# EAGLE design line_kick (EAGLE 9.4.0)
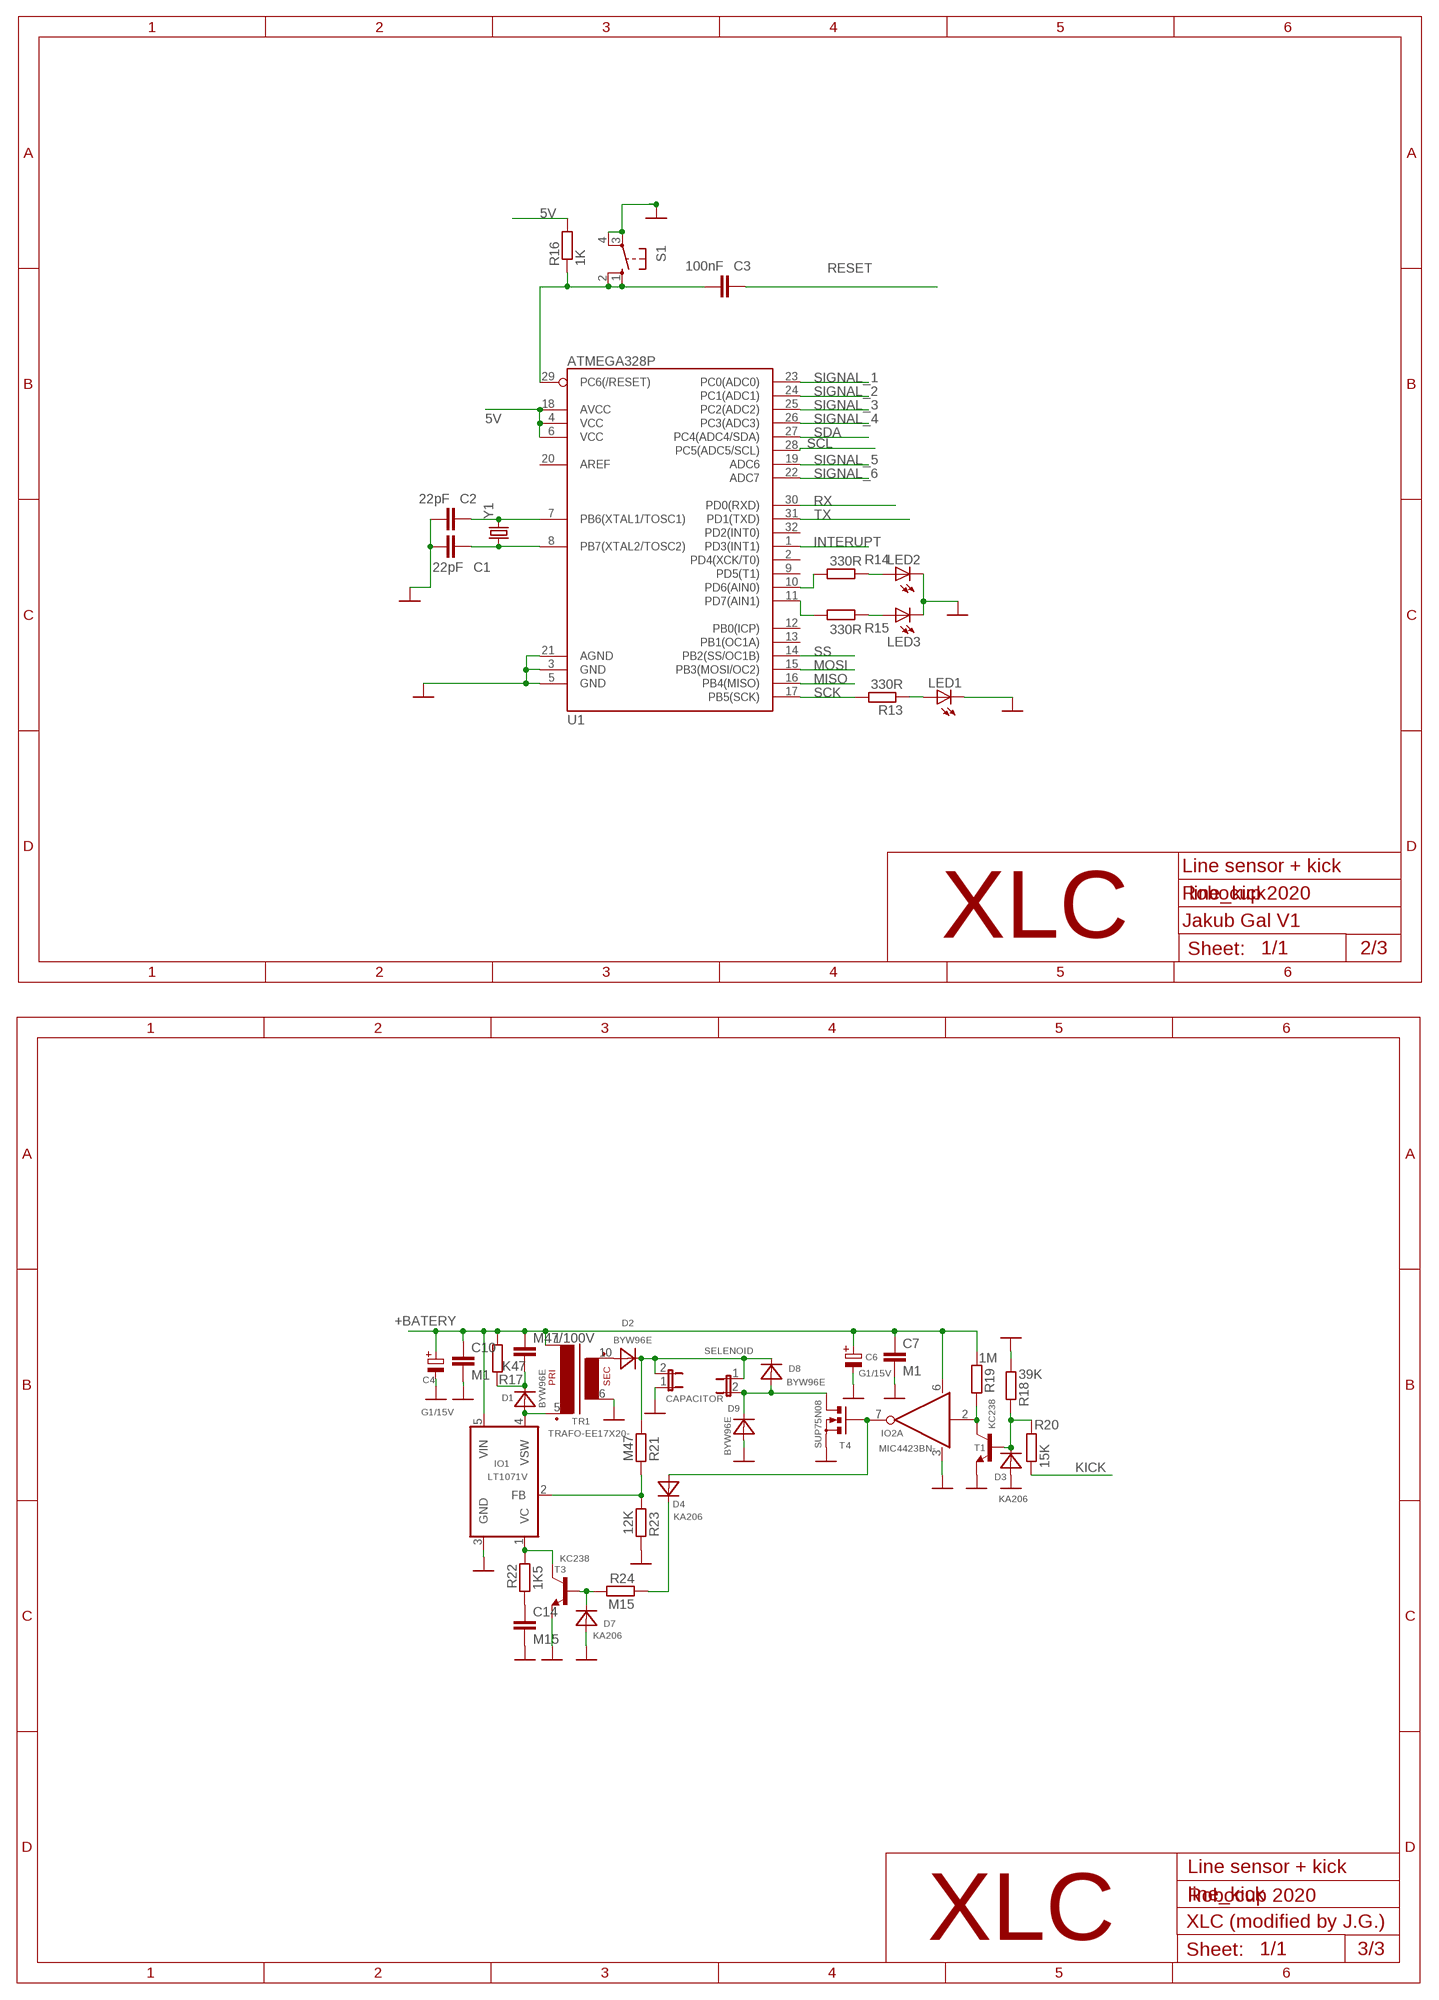
[diagram p0: schematic, sheet 1, part 1 of 2]
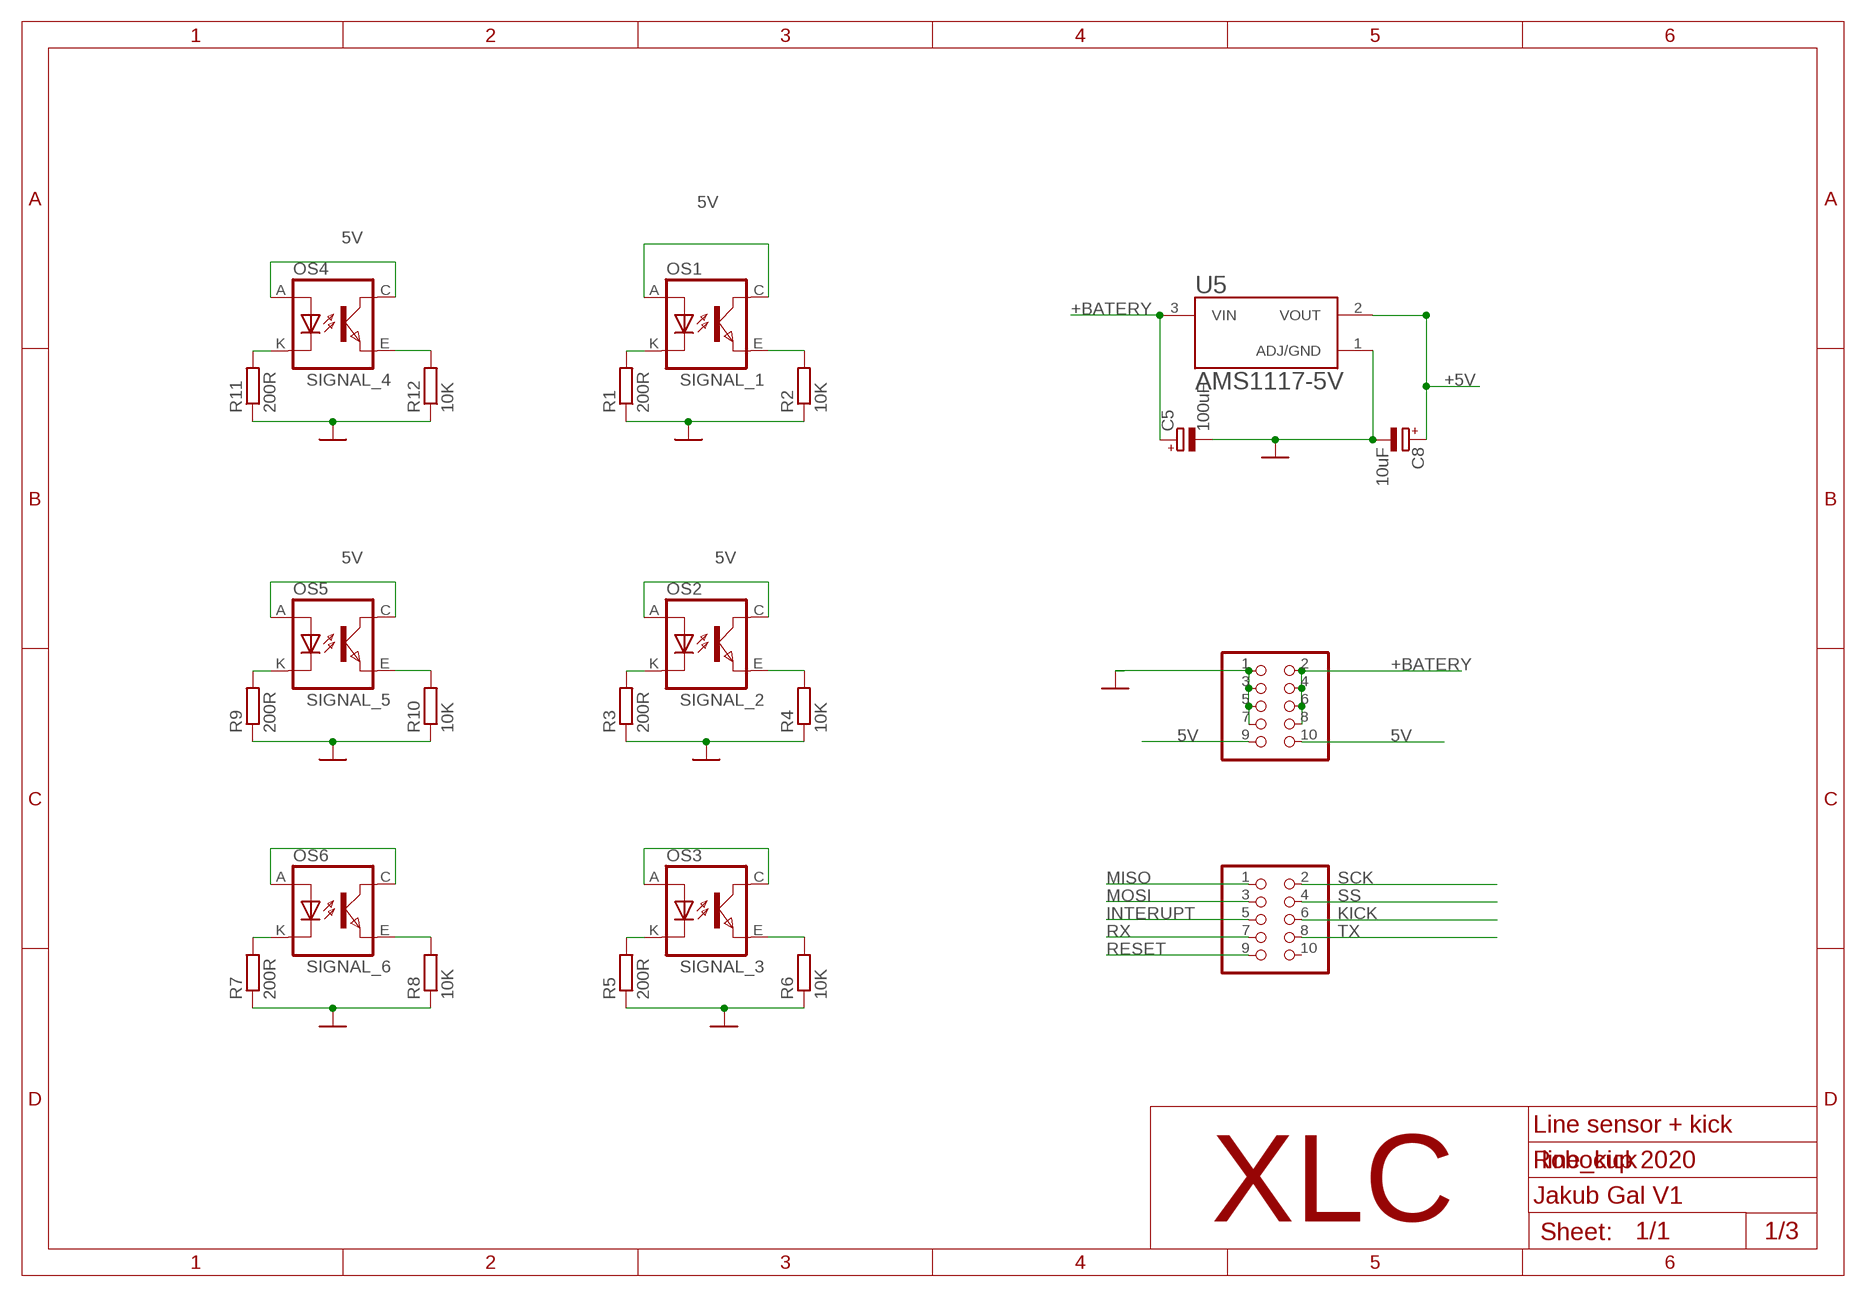
[diagram p1: schematic, sheet 1, part 2 of 2]

## Parts
C1  22pF  C-EUC0603  [C0603]
C2  22pF  C-EUC0603  [C0603]
C3  100nF  C-EUC0603  [C0603]
C4  G1/15V  KOND-ELEKT-2,5/7  [E-2,5/7-RAD]
C5  100uF  CPOL-EUUD-6,3X7,7  [UD-6,3X7,7_NICHICON]
C6  G1/15V  KOND-ELEKT-2,5/7  [E-2,5/7-RAD]
C7  M1  C-EUC0805K  [C0805K]
C8  10uF  CPOL-EUUD-4X5,8  [UD-4X5,8_NICHICON]
C10  M1  C-EUC0805K  [C0805K]
C14  M15  C-EUC0805K  [C0805K]
CAPACITOR  JP2EN  [JP2E]
D1  BYW96E  DIODA-10MM  [D-10]
D2  BYW96E  DIODA-10MM  [D-10]
D3  KA206  DIODA-7,5MM  [D-7,5]
D4  KA206  DIODA-7,5MM  [D-7,5]
D7  KA206  DIODA-7,5MM  [D-7,5]
D8  BYW96E  DIODA-10MM  [D-10]
D9  BYW96E  DIODA-10MM  [D-10]
IO1  LT1071V  [TO-220-5P]
IO2  MIC4423BN-  [DIL8]
JP2  PINHD-2X5  [2X05]
JP3  PINHD-2X5  [2X05]
LED1  LEDCHIPLED_0603  [CHIPLED_0603]
LED2  LEDCHIPLED_0603  [CHIPLED_0603]
LED3  LEDCHIPLED_0603  [CHIPLED_0603]
M47/100V  C-EUC0805K  [C0805K]
OS1  TCRT5000  [TCRT5000]
OS2  TCRT5000  [TCRT5000]
OS3  TCRT5000  [TCRT5000]
OS4  TCRT5000  [TCRT5000]
OS5  TCRT5000  [TCRT5000]
OS6  TCRT5000  [TCRT5000]
R1  200R  R-EU_R0603  [R0603]
R2  10K  R-EU_R0603  [R0603]
R3  200R  R-EU_R0603  [R0603]
R4  10K  R-EU_R0603  [R0603]
R5  200R  R-EU_R0603  [R0603]
R6  10K  R-EU_R0603  [R0603]
R7  200R  R-EU_R0603  [R0603]
R8  10K  R-EU_R0603  [R0603]
R9  200R  R-EU_R0603  [R0603]
R10  10K  R-EU_R0603  [R0603]
R11  200R  R-EU_R0603  [R0603]
R12  10K  R-EU_R0603  [R0603]
R13  330R  R-EU_R0603  [R0603]
R14  330R  R-EU_R0603  [R0603]
R15  330R  R-EU_R0603  [R0603]
R16  1K  R-EU_R0603  [R0603]
R17  K47  R-EU_R0603  [R0603]
R18  39K  R-EU_R0603  [R0603]
R19  1M  R-EU_R0603  [R0603]
R20  15K  R-EU_R0603  [R0603]
R21  M47  R-EU_R0603  [R0603]
R22  1K5  R-EU_R0603  [R0603]
R23  12K  R-EU_R0603  [R0603]
R24  M15  R-EU_R0603  [R0603]
S1  10-XX  [B3F-10XX]
SELENOID  JP2EN  [JP2E]
T1  KC238  TRANZ-NPN-KC238-PLAST  [TO-92]
T3  KC238  TRANZ-NPN-KC238-PLAST  [TO-92]
T4  SUP75N08  BUZ90"  [TO-220]
TR1  TRAFO-EE17X20-  [TRAFO-EE17X20]
U1  ATMEGA328P  ATMEGA328_SMT  [TQFP32-08]
U5  AMS1117-5V  AMS1117-3.3  [SOT229P700X180-4N]
Y1  CRYSTALHC49US  [HC49US]

## Nets
5V: JP3.9 JP3.10 OS1.A(ANODE) OS1.C(COLLECTOR) OS2.A(ANODE) OS2.C(COLLECTOR) OS3.A(ANODE) OS3.C(COLLECTOR) OS4.A(ANODE) OS4.C(COLLECTOR) OS5.A(ANODE) OS5.C(COLLECTOR) OS6.A(ANODE) OS6.C(COLLECTOR) R16.2 U1.4(VCC) U1.6(VCC) U1.18(AVCC)
+5V: C8.+ U5.2(VOUT)
+BATERY: C4.+ C5.+ C6.+ C7.1 C10.1 IO1.5(VIN) IO2.6(G:VCC) JP3.2 JP3.4 JP3.6 JP3.8 M47/100V.1 R17.1 R19.2 TR1.1 U5.3(VIN)
GND: C1.1 C2.1 C4.- C5.- C6.- C7.2 C8.- C10.2 C14.2 CAPACITOR.1 D3.A D7.A D9.A IO1.3(GND) IO2.3(G:GND) JP3.1 JP3.3 JP3.5 JP3.7 LED1.C LED2.C LED3.C R1.1 R2.1 R3.1 R4.1 R5.1 R6.1 R7.1 R8.1 R9.1 R10.1 R11.1 R12.1 R18.2 R23.1 S1.3(P) S1.4(P1) T1.3(E) T3.3(E) T4.3(S) TR1.6 U1.3(GND) U1.5(GND) U1.21(AGND) U5.1(ADJ/GND)
INTERUPT: JP2.5 U1.1(PD3(INT1))
KICK: JP2.6 R20.1
MISO: JP2.1 U1.16(PB4(MISO))
MOSI: JP2.3 U1.15(PB3(MOSI/OC2))
N$1: OS1.K(CATHODE) R1.2
N$2: OS2.K(CATHODE) R3.2
N$3: OS3.K(CATHODE) R5.2
N$4: OS6.K(CATHODE) R7.2
N$5: OS5.K(CATHODE) R9.2
N$6: OS4.K(CATHODE) R11.2
N$7: C2.2 U1.7(PB6(XTAL1/TOSC1)) Y1.2
N$8: C1.2 U1.8(PB7(XTAL2/TOSC2)) Y1.1
N$9: IO1.1(VC) R22.1 T3.1(C)
N$10: C14.1 R22.2
N$12: D2.A TR1.10
N$13: CAPACITOR.2 D2.K D8.K R21.2 SELENOID.1
N$14: IO1.2(FB) R21.1 R23.2
N$15: D7.K R24.2 T3.2(B)
N$16: C3.1 R16.1 S1.1(S) S1.2(S1) U1.29(PC6(/RESET))
N$17: LED1.A R13.1
N$18: IO2.2(A:I) R19.1 T1.1(C)
N$19: LED2.A R14.1
N$20: R15.2 U1.11(PD7(AIN1))
N$21: LED3.A R15.1
N$22: R14.2 U1.10(PD6(AIN0))
N$23: D1.A IO1.4(VSW) TR1.5
N$24: D1.K M47/100V.2 R17.2
N$25: D4.A IO2.7(A:O) T4.1(G)
N$26: D8.A D9.K SELENOID.2 T4.2(D)
N$29: D4.K R24.1
N$31: D3.K R18.1 R20.2 T1.2(B)
RESET: C3.2 JP2.9
RX: JP2.7 U1.30(PD0(RXD))
SCK: JP2.2 R13.2 U1.17(PB5(SCK))
SCL: U1.28(PC5(ADC5/SCL))
SDA: U1.27(PC4(ADC4/SDA))
SIGNAL_1: OS1.E(EMITTER) R2.2 U1.23(PC0(ADC0))
SIGNAL_2: OS2.E(EMITTER) R4.2 U1.24(PC1(ADC1))
SIGNAL_3: OS3.E(EMITTER) R6.2 U1.25(PC2(ADC2))
SIGNAL_4: OS4.E(EMITTER) R12.2 U1.26(PC3(ADC3))
SIGNAL_5: OS5.E(EMITTER) R10.2 U1.19(ADC6)
SIGNAL_6: OS6.E(EMITTER) R8.2 U1.22(ADC7)
SS: JP2.4 U1.14(PB2(SS/OC1B))
TX: JP2.8 U1.31(PD1(TXD))
Unconnected: IO2.4(B:I) IO2.5(B:O) JP2.10 U1.2(PD4(XCK/T0)) U1.9(PD5(T1)) U1.12(PB0(ICP)) U1.13(PB1(OC1A)) U1.20(AREF) U1.32(PD2(INT0))

## Notes on the sheet
- Line sensor + kick
- Robocup 2020
- Jakub Gal V1
- XLC
- 2/3
- Line sensor + kick
- Robocup 2020
- XLC (modified by J.G.)
- XLC
- 3/3
- Line sensor + kick
- Robocup 2020
- Jakub Gal V1
- XLC
- 1/3

## Library data of the parts
C1-C3 = rcl:C-EU: CAPACITOR, European symbol
C4 C6 = TABOR K1:KOND-ELEKT: Kondenzátor elektrolyticky
C5 C8 = rcl:CPOL-EU: POLARIZED CAPACITOR, European symbol; SPICEPREFIX: C
C7 C10 C14 M47/100V = resistor:C-EU: CAPACITOR, European symbol
CAPACITOR SELENOID = TABOR K1:JP2E: JAMPER 2 PIN
D1-D4 D7-D9 = TABOR K1:DIODA: Dioda
IO1 = TABOR K1:LT1071: DC/DC pulzný IO
IO2 = TABOR K1:MIC4423BN: Dvojity invertor - budic FET tranzistorov
JP2 JP3 = pinhead:PINHD-2X5: PIN HEADER
LED1-LED3 = audio amplifier example:LED
OS1-OS3 OS5 = tcrt5000:TCRT5000
OS4 OS6 = tcrt5000:TCRT5000; SPICEPREFIX: O
R1-R16 = rcl:R-EU_: RESISTOR, European symbol; SPICEPREFIX: R
R17-R24 = resistor:R-EU_: RESISTOR, European symbol
S1 = switch-omron:10-XX: OMRON SWITCH; MPN: B3F-1000; OC_FARNELL: 176432; OC_NEWARK: 36M3542
T1 T3 = TABOR K1:TRANZ-NPN: Tranzistor bipolárny NPN
T4 = TABOR K1:BUZ90: vykonovy FET
TR1 = TABOR K1:TRAFO-EE17X20: Trafo na ferite EE17x20 - 1 primar, 1 sekundar
U1 = SparkFun-DigitalIC:ATMEGA328_SMT: 32-Pin Atmega328 part Commonly used on Arduino compatible boards Available in QFP and QFN packages TQFP is IC-09069 QFN is non-stock; PROD_ID: IC-09069
U5 = AMS1117-3.3:AMS1117-3.3: Sot223/Pkg 1-Amp 3.3-Volt Low Drop Out Voltage Regulatator; AVAILABILITY: Unavailable; DESCRIPTION: Sot223/Pkg 1-Amp 3.3-Volt Low Drop Out Voltage Regulatator; MF: Advanced Monolithic Systems; MP: AMS1117-3.3; PACKAGE: None; PRICE: None
Y1 = SparkFun-FreqCtrl:CRYSTAL: Various standard crystals. Proven footprints. Spark Fun Electronics SKU : COM-00534

## Board
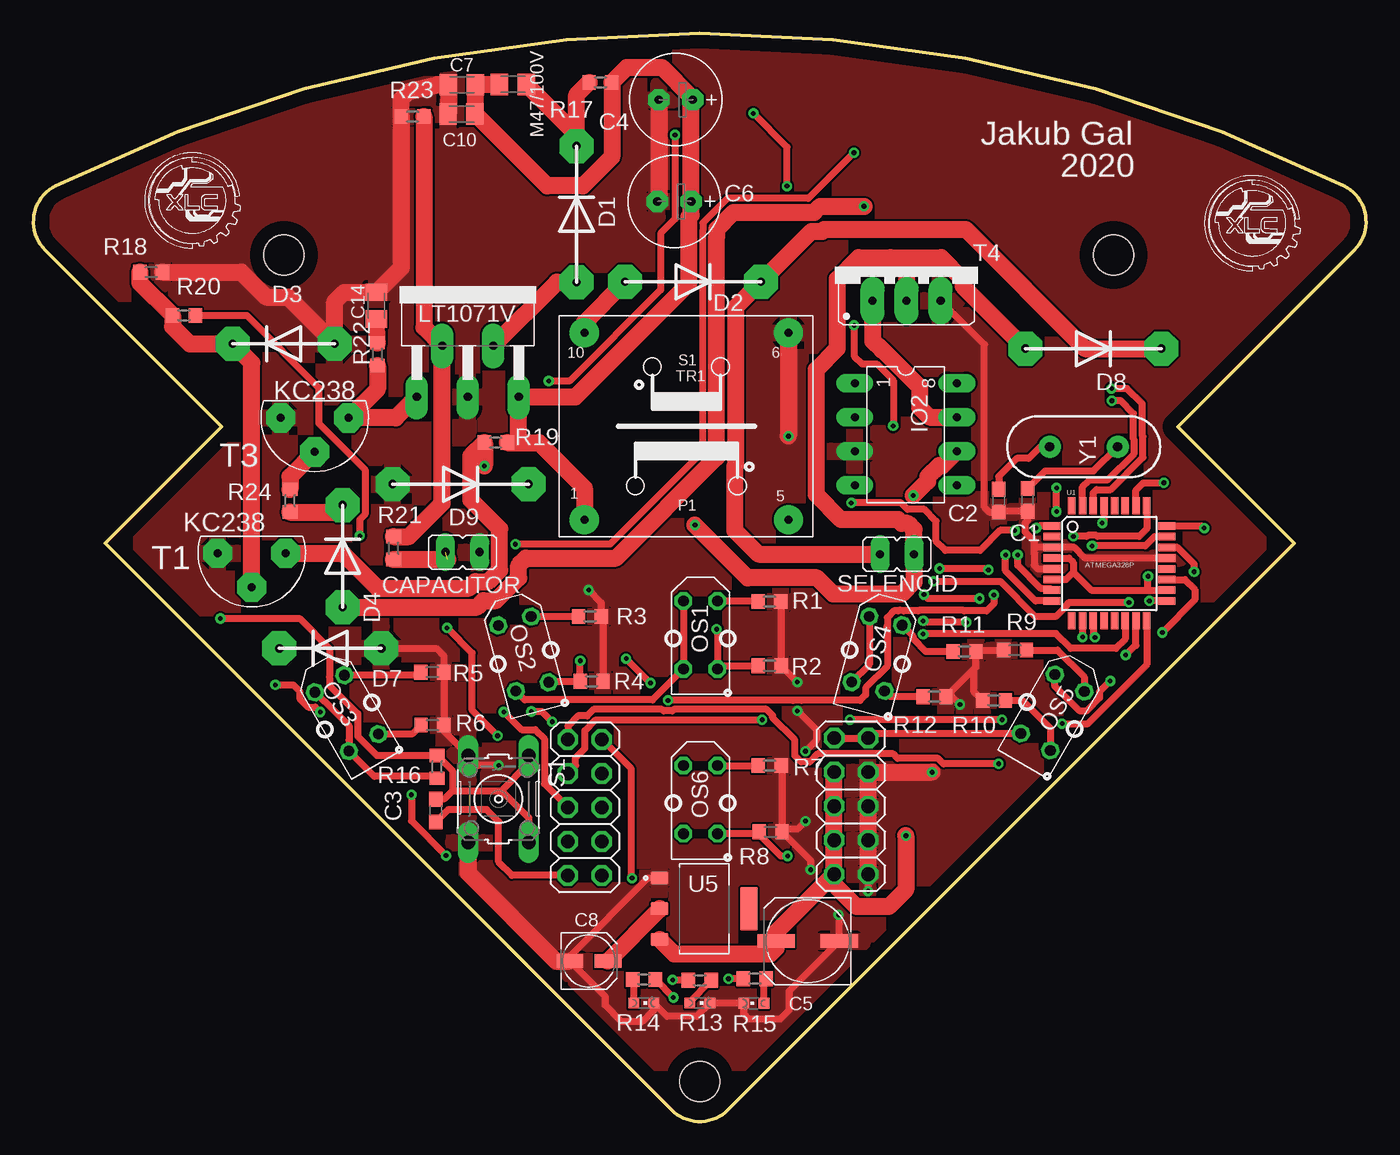
[diagram p2: board, top side]
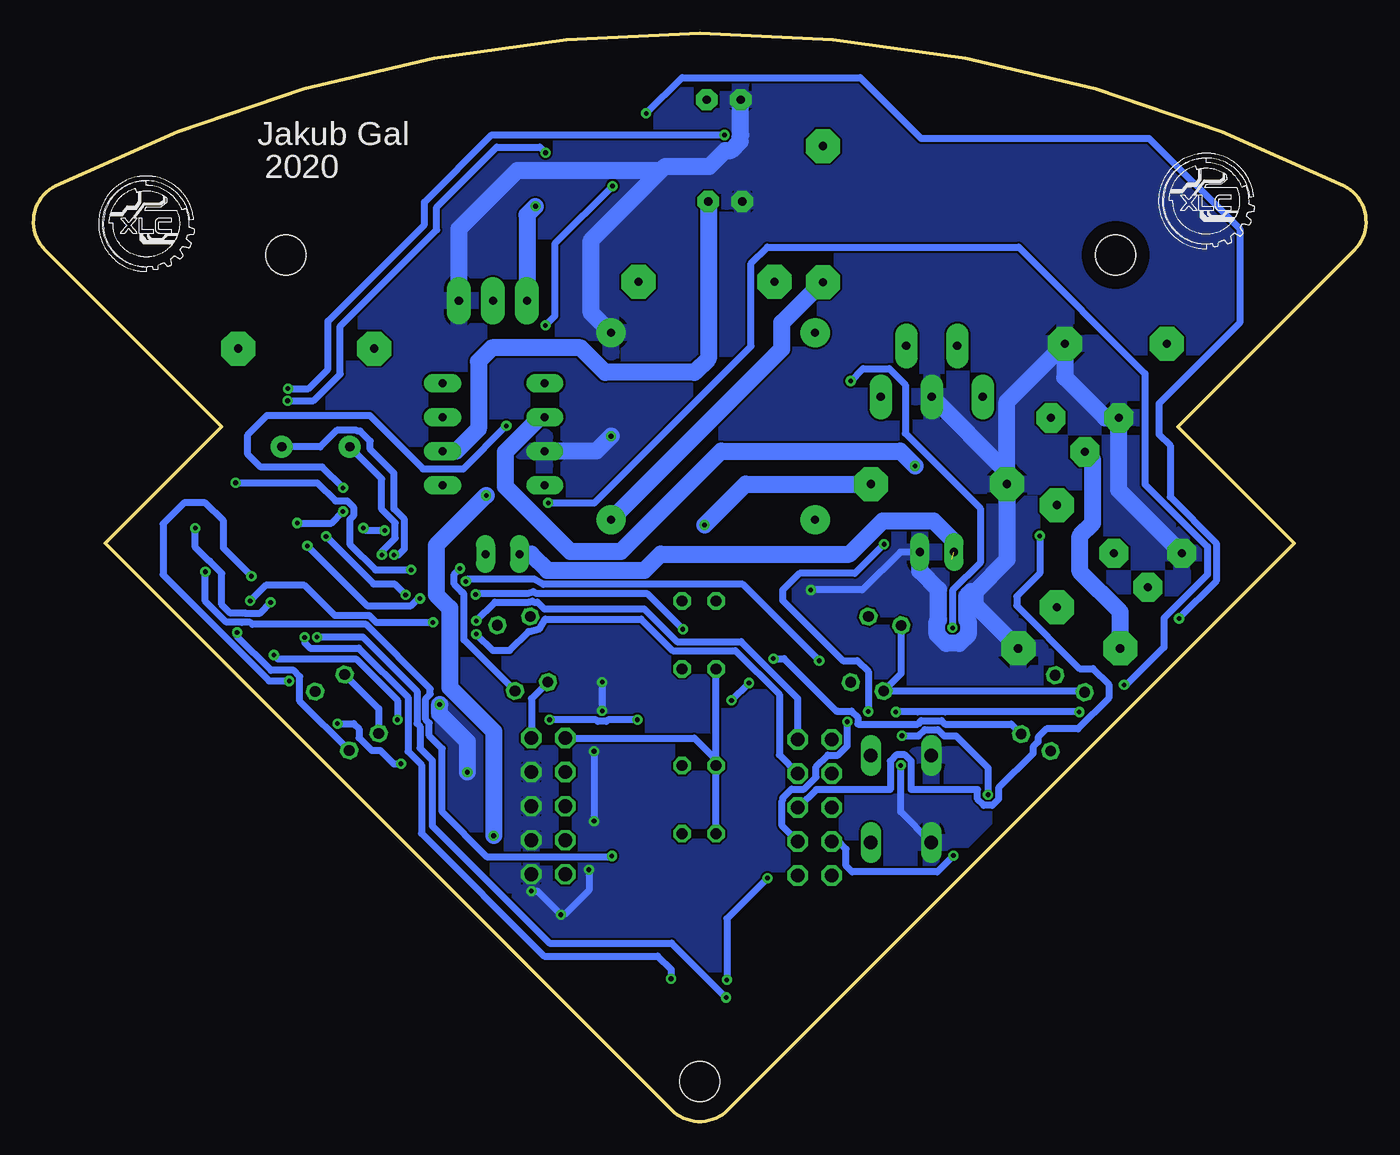
[diagram p3: board, bottom side, seen from below]

Size 99.55 x 81.25 mm. Coordinates in mm from the lower left corner, seen from the top.
Outline: 85.49,51.89 98.67,65.08 arc108 97.9,69.88 arc53 1.66,69.88 arc108 0.88,65.08 14.07,51.89 5.35,43.18 47.66,0.87 arc90 51.9,0.87 94.2,43.18 85.49,51.89
Copper layers (1*16): Top 0.035mm / dielectric 1.5mm / Bottom 0.035mm
Design rules "default": minimum track width 6mil, minimum drill 0.35mm, track to track 6mil, track to pad 6mil, pad to pad 6mil, via to via 6mil, smd to smd 6mil, copper to edge 40mil, drill to drill 6mil, minimum pad ring 10mil, minimum via ring 8mil, stop-mask expansion 4mil, vias tented up to drill 0mil, thermal gap 10mil
Holes 3 mm at 49.78,3 18.71,64.71 80.71,64.71

### Footprints (pad centres in the part's own frame; a part is rotated, then mirrored left to right if it is on the bottom)
C0603 = smd 1.1 x 1: 1 -0.85,0; 2 0.85,0
E-2,5/7-RAD = drill 0.61 pad 1.6 octagon: + -1.27,0; - 1.27,0
UD-6,3X7,7_NICHICON = smd 2.8 x 1: + 2.35,0; - -2.35,0
C0805K = smd 1.3 x 1.6: 1 -1,0; 2 1,0
UD-4X5,8_NICHICON = smd 2 x 1: + 1.425,0; - -1.425,0
JP2E = drill 0.61 pad 1.422 long: 1 0,-1.27; 2 0,1.27
D-10 = drill 0.61 pad 2.54 octagon: A 5.08,0; K -5.08,0
D-7,5 = drill 0.61 pad 2.54 octagon: A 3.81,0; K -3.81,0
TO-220-5P = drill 0.61 pad 1.676 long: 1 -3.81,0; 2 -1.905,3.81; 3 0,0; 4 1.905,3.81; 5 3.81,0
DIL8 = drill 0.61 pad 1.4 long: 1 -3.81,-3.81; 2 -1.27,-3.81; 3 1.27,-3.81; 4 3.81,-3.81; 5 3.81,3.81; 6 1.27,3.81; 7 -1.27,3.81; 8 -3.81,3.81
2X05 = drill 1.016 octagon: 1 -5.08,-1.27; 2 -5.08,1.27; 3 -2.54,-1.27; 4 -2.54,1.27; 5 0,-1.27; 6 0,1.27; 7 2.54,-1.27; 8 2.54,1.27; 9 5.08,-1.27; 10 5.08,1.27
CHIPLED_0603 = smd 0.8 x 0.8: A 0,-0.75; C 0,0.75
TCRT5000 = drill 0.8 octagon: A -2.54,-1.27; C 2.54,-1.27; E 2.54,1.27; K -2.54,1.27
R0603 = smd 1 x 1.1: 1 -0.85,0; 2 0.85,0
B3F-10XX = drill 1.016 long: 1 -3.251,2.261; 2 3.251,2.261; 3 -3.251,-2.261; 4 3.251,-2.261
TO-92 = drill 0.61 pad 2.184 octagon: 1 -2.54,0; 2 0,2.54; 3 2.54,0
TO-220 = drill 0.61 pad 1.778 long: 1 -2.54,0; 2 0,0; 3 2.54,0
TRAFO-EE17X20 = drill 0.61 pad 2.184: 1 -7.62,-7.62; 5 7.62,-7.62; 6 7.62,6.35; 10 -7.62,6.35
TQFP32-08 = smd 1.27 x 0.559: 1 -4.293,2.8; 2 -4.293,2; 3 -4.293,1.2; 4 -4.293,0.4; 5 -4.293,-0.4; 6 -4.293,-1.2; 7 -4.293,-2; 8 -4.293,-2.8; 17 4.293,-2.8; 18 4.293,-2; 19 4.293,-1.2; 20 4.293,-0.4; 21 4.293,0.4; 22 4.293,1.2; 23 4.293,2; 24 4.293,2.8 | smd 0.559 x 1.27: 9 -2.8,-4.293; 10 -2,-4.293; 11 -1.2,-4.293; 12 -0.4,-4.293; 13 0.4,-4.293; 14 1.2,-4.293; 15 2,-4.293; 16 2.8,-4.293; 25 2.8,4.293; 26 2,4.293; 27 1.2,4.293; 28 0.4,4.293; 29 -0.4,4.293; 30 -1.2,4.293; 31 -2,4.293; 32 -2.8,4.293
SOT229P700X180-4N = smd 0.93 x 1.31: 1 -2.29,-3.345; 2 0,-3.345; 3 2.29,-3.345 | smd 3.24 x 1.31: 4 0,3.345
HC49US = drill 0.7 pad 1.651: 1 -2.54,0; 2 2.54,0

### Placement (x,y rotation side)
C1  74.26,46.42 90 top
C2  72.12,46.37 90 top
C3  30.05,23.22 270 top
C4  47.99,76.31 180 top
C5  57.84,13.47 180 top
C6  47.87,68.71 180 top
C7  32,77.43 180 top
C8  41.5,11.99 0 top
C10  31.98,75.24 180 top
C14  25.62,60.93 90 top
CAPACITOR  32.06,42.53 90 top
D1  40.58,67.77 270 top
D2  49.28,62.71 180 top
D3  18.7,58.08 0 top
D4  23.09,42.23 270 top
D7  22.18,35.33 0 top
D8  79.19,57.73 180 top
D9  31.9,47.61 180 top
IO1  32.45,54.12 0 top
IO2  65.17,51.33 270 top
JP2  41.19,23.46 270 top
JP3  61.08,23.55 90 top
LED1  49.79,8.85 270 top
LED2  45.59,8.86 270 top
LED3  53.82,8.83 90 top
M47/100V  35.81,77.45 0 top
OS1  49.83,36.34 270 top
OS2  36.61,34.93 285 top
OS3  23.4,30.5 300 top
OS4  63.01,34.94 255 top
OS5  76.13,30.54 240 top
OS6  49.83,24.04 270 top
R1  54.99,38.83 180 top
R2  55,34.04 180 top
R3  41.57,37.72 180 top
R4  41.7,32.88 180 top
R5  29.8,33.56 180 top
R6  29.81,29.61 180 top
R7  55,26.58 180 top
R8  55.07,21.64 180 top
R9  73.33,35.21 0 top
R10  71.76,31.45 0 top
R11  69.56,35.11 180 top
R12  67.32,31.73 180 top
R13  49.78,10.55 180 top
R14  45.61,10.61 0 top
R15  53.89,10.67 180 top
R16  30.15,26.49 270 top
R17  42.36,77.6 180 top
R18  8.8,63.43 0 top
R19  34.54,50.71 0 top
R20  11.24,60.2 180 top
R21  26.9,42.83 270 top
R22  25.7,57.31 90 top
R23  28.32,75.05 0 top
R24  19.17,46.37 90 top
S1  34.74,24.09 270 top
SELENOID  64.52,42.37 270 top
T1  16.31,42.45 180 top
T3  21.01,52.55 180 top
T4  65.23,61.3 0 top
TR1  48.78,52.56 0 top
U1  80.37,41.68 0 top
U5  50.12,15.9 270 top
Y1  78.46,50.39 180 top

### Tracks (layer width: path | path; a pad name or v marks a point on that pad's centre or on a via)
5V  (via drill 0.35)
  Top 0.508: U1.4 77.36,42.08 77.68,41.76 77.68,41.03 | U1.6 77.13,40.48 77.68,41.03 | 83.27,39.68 79.03,39.68 77.68,41.03 | 83.27,39.68 U1.18 | R16.2 30.01,25.78 25.45,25.78 OS3.C 23.57,28.48 | OS1.A OS1.C 46.25,31.49 36.7,31.49 OS2.C | OS4.A 62.44,34.13 OS4.C | 23.57,28.48 | 83.27,39.68 v83.27,40.73 | v80.44,32.9 79.64,32.1 79.64,31.64 78.65,30.65 78.18,30.65 76.3,32.52 OS5.A | OS3.A 21.72,31.37 21.75,31.37 23.57,29.56 23.57,28.48 | JP3.10 JP3.9 62.7,28.98 OS5.C
  Bottom 0.508: OS3.A 21.11,32.14 OS2.C 34.72,33.46 OS2.A | OS5.A 73.76,30.84 OS5.C | OS4.C 62.35,31.59 JP3.9 | OS6.A 48.56,27.01 50.18,28.63 JP3.10 | OS6.C OS6.A | OS6.A OS1.C | v83.27,40.73 85.36,42.82 85.36,44.85 86.72,46.21 88.31,46.21 89.88,44.64 89.88,40.83 81.95,32.9 v80.44,32.9
+5V
  Top 1.27: U5.2 46.77,15.84 C8.+
+BATERY  (via drill 0.35)
  Top 1.27: R19.2 36.07,50.71 | 36.07,50.71 36.26,50.9 IO1.5 40.48,54.12 48.96,62.6 48.96,66.96 48.97,66.98 48.97,67.54 49.14,67.71 C6.+ 49.14,76.19 | 36.07,50.71 37.76,50.71 41.16,47.31 TR1.1 | 49.14,76.19 C4.+ | 49.14,76.19 49.14,76.53 46.95,78.72 44.33,78.72 R17.1 43.21,72.04 41.05,69.88 38.38,69.88 33,75.26 | M47/100V.1 34.79,77.43 C7.1 33,75.26 | 33,75.26 C10.1 | U5.3 47.85,12.53 55.06,12.53 55.49,12.96 C5.+ 55.49,14.15 JP3.2 | JP3.2 JP3.4 JP3.6 JP3.8 | v65.18,21.35 65.18,17.32 63.9,16.04 61.48,16.04 59.81,17.72 JP3.2 | v65.73,46.75 66.79,47.81 66.79,48.13 67.66,49 67.93,49 IO2.6
  Bottom 1.27: C6.+ 49.14,56.98 50.17,55.95 56.85,55.95 58.68,57.78 65.3,57.78 66.31,56.77 66.31,51.73 67.98,50.06 IO2.6 | v65.73,46.75 69.47,43.02 69.47,39.35 68.46,38.34 68.46,32.41 65.18,29.13 v65.18,21.35
GND  (via drill 0.35)
  Top 0.508: R4.1 42.55,37.59 R3.1 42.42,38.76 v41.48,39.7 | D7.A 30.1,35.33 30.65,34.78 R5.1 R6.1 30.66,29.16 S1.3 33.22,26.6 v34.76,26.6 | R1.1 R2.1 v57.07,32.82 | 70.23,33.78 70.41,33.96 R11.1 70.51,35.21 R9.1 | 70.23,33.78 70.23,33.79 R12.1 68.63,31.73 v69.21,31.15 | 70.23,33.78 70.23,32.12 R10.1 | 55.92,21.83 55.92,26.51 R7.1 | 55.92,21.83 R8.1 | R8.1 56.55,21.01 | U5.1 45.93,18.19 40.07,12.33 C8.- 42.7,9.36 42.7,8.71 43.91,7.5 45.53,7.5 46.34,8.31 LED2.C 47.35,7.85 49.54,7.85 LED1.C 53.05,8.85 LED3.C 53.07,8.05 53.47,7.65 55.78,7.65 56.46,8.33 56.46,9.74 C5.- 60.19,15.41 v60.15,15.45 | U1.21 78.55,42.08 77.75,42.88 U1.3 74.83,42.88 74.79,42.92 | U1.5 75.05,41.28 74.76,41.57 74.76,42.43 74.79,42.46 74.79,42.92 | 74.79,42.92 74.79,43.32 74.09,44.02 74.09,44.71 74.26,44.88 C1.1 72.17,45.57 C2.1 72.14,45.5 71.43,45.5 71.05,45.88 71.05,58.02 T4.3 | JP3.1 v62.35,17.21 | R8.1 58.06,19.5 v58.06,18.8 | v57.07,30.67 58.49,29.25 58.49,28.47 v57.67,27.65 | v57.67,22.44 57.06,21.83 55.92,21.83
  Top 1.27: C4.- 46.72,68.83 C6.- | C10.2 31,75.26 C7.2 30.15,77.43 28.05,76.93 27.47,76.35 R23.1 27.47,63.78 C14.2 23.21,61.93 22.51,61.23 D3.A 19.03,61.56 17.4,61.56 15.53,63.43 R18.2 | S1.4 32.48,18.57 39.06,11.99 C8.- | JP3.1 JP3.3 JP3.5 JP3.7 v67.14,26.09 | TR1.6 v56.4,51.18
  Bottom 0.508: CAPACITOR.1 34.8,42.53 37.63,39.7 v41.48,39.7 | S1.4 34.76,23.12 v34.76,26.6 | v62.35,17.21 61.91,17.21 v60.15,15.45 59.88,15.45 58.06,17.27 v58.06,18.8 | v57.07,32.82 v57.07,30.67 | v57.67,27.65 v57.67,22.44
  Bottom 1.27: D9.A 26.82,41.96 29.2,39.58 | CAPACITOR.1 33.33,41.12 31.93,39.72 31.93,37.47 32.05,37.35 32.05,36.38 31.37,35.7 30.41,35.7 29.72,36.38 29.72,37.35 29.85,37.47 29.85,39.23 29.5,39.58 29.2,39.58 | D9.A 26.82,48.49 IO1.3 | D9.A 26.82,53.77 D3.A 22.51,55.58 19.48,52.55 T3.3 18.47,47.15 T1.3 | D7.A 29.2,38.54 29.2,39.58 | C4.- 46.72,73.67 46.76,73.62 46.76,73.19 47.45,72.51 47.88,72.51 49.06,71.33 52.37,71.33 52.67,71.02 | TR1.6 57.89,60.4 57.89,65.81 52.67,71.02 | T4.3 67.77,66.66 63.4,71.02 52.67,71.02 | v67.14,26.09 67.14,28.38 69.21,30.45 v69.21,31.15 | IO2.3 57.52,50.06 v56.4,51.18
  pour Top: -9,-2 109,-2 109,87 -9,87
  pour Bottom: 111,92 111,-3 -11,-3 -11,92
INTERUPT  (via drill 0.35)
  Top 0.508: U1.1 75.16,44.48 75.01,44.33 v74.91,44.33 | v73.31,44.14 72.21,44.14 70.73,42.66 68.12,42.66 67.43,43.35 67.43,44.84 66.55,45.71 65.3,45.71 64.82,46.2 v61.1,46.2 | v18.08,32.6 19.41,32.6 19.89,32.12 19.89,31.59 20.53,30.95 21.06,30.95 v21.43,30.59 | v35.13,30.59 36.45,29.27 37.48,29.27 38.17,28.58 38.17,25.21 JP2.5
  Bottom 0.508: v74.91,44.33 v74.91,44.32 74.73,44.14 v73.31,44.14 | v61.1,46.2 57.65,46.2 45.94,57.91 45.94,64.09 44.73,65.3 25.95,65.3 16.51,55.86 16.51,47.59 11.85,42.93 11.85,40.84 15.1,37.59 15.1,35.41 17.9,32.6 v18.08,32.6 | v21.43,30.59 31.44,30.59 31.45,30.59 33.51,30.59 v35.13,30.59
KICK  (via drill 0.35)
  Top 0.508: R20.1 15.93,60.2 21.32,54.81 21.32,52.14 24.76,48.69 24.76,45.34 24.38,44.96 v24.38,43.74
  Bottom 0.508: v24.38,43.74 24.38,40.94 26.1,39.22 26.1,38.53 21.4,33.83 20.4,33.83 19.22,32.65 19.22,31.62 21.52,29.32 23.88,29.32 24.51,28.69 24.51,28.36 24.89,27.98 24.89,27.48 27.45,24.91 27.45,24.07 27.91,23.61 28.56,23.61 29.02,24.07 29.02,24.78 33.97,24.78 33.97,26.92 34.43,27.38 35.08,27.38 35.54,26.92 35.54,24.78 41.07,24.78 42.39,23.46 JP2.6
MISO  (via drill 0.35)
  Top 0.508: U1.16 83.17,34.12 78.72,29.68 76.88,29.68 v76.84,29.72 | JP2.1 39.92,29.53 40.68,30.29 41.36,30.29 41.86,30.78 46.95,30.78 47.07,30.66 47.72,30.66 47.84,30.78 54.76,30.78 55.22,30.32 55.22,30.16 56.88,28.5 56.88,27.32 57.34,26.86 57.99,26.86 58.58,27.45 64.23,27.45 64.55,27.13 67.57,27.13 67.98,26.72 v72.1,26.72
  Bottom 0.508: v76.84,29.72 75.63,29.72 75.23,29.32 75.23,28.66 74.29,27.72 73.64,27.72 72.64,26.72 v72.1,26.72
MOSI  (via drill 0.35)
  Top 0.508: U1.15 82.37,35.57 82.32,35.57 v81.59,34.84 | v54.44,30 42.01,30 41.2,29.19 41.2,27.87 40.51,27.18 40.51,26.58 JP2.3 | v61,30 61.02,30.02 72.34,30.02 v72.36,30
  Bottom 0.508: v72.36,30 72.36,31.46 75.46,34.56 81.31,34.56 v81.59,34.84 | v54.44,30 56.63,30 56.74,29.88 57.39,29.88 57.51,30 v61,30
N$1
  Top 0.508: OS1.K 54.09,38.88 R1.2
N$2
  Top 0.508: OS2.K R3.2
N$3
  Top 0.508: R5.2 28.72,33.33 OS3.K
N$4
  Top 0.508: OS6.K R7.2
N$5
  Top 0.508: R9.2 76.51,35.21 78.5,33.21 OS5.K
N$6
  Top 0.508: OS4.K 65.68,36.27 65.68,36.07 66.65,35.11 R11.2
N$7  (via drill 0.35)
  Top 0.508: Y1.2 75.21,50.39 74.35,49.53 73.46,49.53 72.12,48.19 C2.2 | U1.7 75.96,39.79 75.27,39.79 73.53,41.53 v73.53,42.32
  Bottom 0.508: Y1.2 73.53,48 73.53,45.72 72.52,44.71 72.52,43.56 73.53,42.56 v73.53,42.32
N$8  (via drill 0.35)
  Top 0.508: U1.8 74.86,38.88 72.62,41.12 v72.62,42.32 | Y1.1 79.2,48.59 75.58,48.59 C1.2
  Bottom 0.508: Y1.1 78.12,50.39 76.89,51.62 75.41,51.62 75.36,51.57 75.14,51.57 74.39,50.82 74.39,50.19 72.62,48.43 72.62,45.75 71.84,44.98 71.84,42.76 72.28,42.32 v72.62,42.32
N$9
  Top 1.27: IO1.1 27.07,52.55 T3.1 25.7,54.7 R22.1
N$10
  Top 1.27: R22.2 C14.1
N$12
  Top 1.27: TR1.10 41.16,59.67 D2.A
N$13  (1 unrouted)
  Top 1.27: R21.2 30.94,41.98 | SELENOID.1 54.17,42.37 52.39,44.15 52.39,48.93 52.46,49.01 52.46,60.81 D2.K 58.12,66.47 58.91,66.47 59.07,66.63 69.65,66.63 78.55,57.73 D8.K
  Bottom 1.27: CAPACITOR.2 30.79,43.33 32.32,44.86 36.11,44.86 38.6,42.37 52.7,42.37 53.91,41.16 61.15,41.16 62.36,42.37 SELENOID.1
N$14
  Top 1.27: R21.1 28.04,43.68 30.54,46.18 IO1.2 29.17,59.3 R23.2
N$15
  Top 1.27: T3.2 19.17,48.17 R24.2
  Bottom 1.27: D7.K 18.37,38.07 21.37,41.07 21.37,43.74 20.42,44.69 20.42,49.42 T3.2
N$16  (via drill 0.35)
  Top 0.508: 31.31,24.72 31.31,26.18 R16.1 25.65,27.34 24.23,28.76 24.23,30.47 22.14,32.56 22.14,33.1 22.09,33.18 22.14,33.36 22.14,35.3 19.87,37.57 v13.97,37.57 | 31.31,24.72 30.66,24.07 C3.1 | 31.31,24.72 34.98,24.72 | 34.98,24.72 37,26.74 S1.1 | 34.98,24.72 37,22.7 S1.2 | U1.29 79.97,45.04 79.96,45.03 79.96,44.82 v79.84,44.7 | v76.43,45.56 v76.43,47.32 | v56.3,69.86 56.3,72.77 v53.78,75.29 | v61.31,59.46 61.31,57.17 61.9,56.58 63.01,56.58 64.23,55.36 v64.23,51.95
  Bottom 0.508: v79.84,44.7 77.29,44.7 v76.43,45.56 | v76.43,47.32 77.98,48.87 82.58,48.87 83.54,49.83 83.54,51.29 82.1,52.73 74.43,52.73 70.45,48.75 67.43,48.75 v64.23,51.95 | v56.3,69.86 60.62,65.54 60.62,60.15 v61.31,59.46 | v53.78,75.29 51.1,77.97 37.78,77.97 33.24,73.43 16.21,73.43 9.44,66.66 9.44,59.64 15.46,53.61 15.46,51.31 14.64,50.48 14.64,46.65 11.19,43.2 11.19,40.35 v13.97,37.57
N$17
  Top 0.508: LED1.A 49.04,8.96 R13.1
N$18  (via drill 0.35)
  Top 1.27: T1.1 23.1,42.45 25.71,39.84 32.54,39.84 33.02,40.32 33.95,40.32 34.83,41.19 34.83,44.26 32.69,46.4 32.69,49.71 R19.1 v33.69,48.96
  Bottom 1.27: v33.69,48.96 34.8,50.07 48.19,50.07 55.67,42.58 59.45,42.58 64.31,47.44 64.31,50 61.71,52.6 IO2.2
N$19
  Top 0.508: R14.1 44.84,10.53 LED2.A
N$20  (via drill 0.35)
  Top 0.508: U1.11 79.17,36.28 v79.29,36.16 | R15.2 v51.92,10.67
  Bottom 0.508: v79.29,36.16 79.29,35.75 78.89,35.35 75.25,35.35 71.57,31.67 71.57,27.64 70.57,26.64 70.57,21.52 61.41,12.36 52.92,12.36 51.92,11.36 v51.92,10.67
N$21
  Top 0.508: LED3.A 54.57,10.5 R15.1
N$22  (via drill 0.35)
  Top 0.508: U1.10 v78.37,36.18 | R14.2 v47.81,9.26
  Bottom 0.508: v78.37,36.18 v78.36,36.19 74.95,36.19 70.91,32.14 70.91,29.74 70.68,29.51 70.68,27.88 69.77,26.97 69.77,22.06 69.75,22.06 61.01,13.32 51.87,13.32 v47.81,9.26
N$23
  Top 1.27: IO1.4 39.11,62.69 D1.A
  Bottom 1.27: TR1.5 43.64,57.7 43.64,59.67 40.62,62.69 D1.A
N$24
  Top 1.27: R17.2 40.58,76.67 D1.K 40.58,73.68 M47/100V.2
N$25  (via drill 0.35)
  Top 1.27: T4.1 62.69,58.31 63.38,57.62 63.44,57.62 66.2,54.86 66.2,53.34 66.94,52.6 IO2.7 | D4.A 33.13,38.42 33.61,38.89 34.54,38.89 36.25,40.61 36.25,41.54 36.79,42.08 43.52,42.08 51.04,49.6 51.04,66.1 51.05,66.11 51.05,66.65 52.3,67.9 58.32,67.9 58.77,68.35 v62.05,68.35
  Bottom 1.27: v62.05,68.35 62.69,67.71 T4.1
N$26  (via drill 0.35)
  Top 1.27: 64.05,64.51 61.65,64.51 60.06,62.92 60.06,57.74 58.48,56.16 58.48,46.82 60.34,44.96 64.58,44.96 64.87,44.67 65.31,44.67 65.79,44.2 SELENOID.2 65.79,40.3 64.87,39.38 59.75,39.38 58.52,40.61 53.36,40.61 v49.42,44.55 | 64.05,64.51 65.23,63.33 T4.2 | D8.A 69.44,62.39 69.44,62.88 67.82,64.51 64.05,64.51
  Bottom 1.27: D9.K 46.36,47.61 v49.42,44.55
N$29
  Top 1.27: R24.1 22.57,45.52 D4.K
N$31
  Top 1.27: T1.2 16.31,56.66 D3.K 11.68,58.08 10.39,59.37 R20.2 7.95,62.64 R18.1
RESET
  Top 0.508: JP2.9 35.75,18.38 34.76,19.37 34.76,22.4 33.86,23.3 30.98,23.3 C3.2
RX  (via drill 0.35)
  Top 0.508: U1.30 79.17,46.95 79.42,47.2 80.48,47.2 82.89,49.6 82.89,51.17 82.83,51.23 82.83,53.6 81.7,54.74 v80.54,54.74 | v47.93,73.68 47.93,67.41 46.85,66.33 46.85,62.11 40.04,55.3 v38.5,55.3 | v30.89,36.87 32.77,34.99 32.77,30.71 v34.67,28.81 | v28.24,24.4 28.24,22.44 v30.82,19.86
  Bottom 0.508: v80.54,54.74 | v80.54,54.74 79,54.74 77.54,56.2 77.54,59.77 70.34,66.97 70.34,68.66 65.33,73.68 v47.93,73.68 | v38.5,55.3 37.58,56.22 35.62,56.22 34.42,55.02 34.42,51.39 28.82,45.79 28.82,41.73 30.89,39.66 v30.89,36.87 | v34.67,28.81 33.42,28.81 32.96,29.27 31.99,29.27 31.53,28.81 30.64,28.81 28.24,26.41 v28.24,24.4 | v30.82,19.86 32.03,18.65 38.39,18.65 38.84,19.1 38.84,20.35 39.41,20.92 JP2.7
SCK  (via drill 0.35)
  Top 0.508: U1.17 v83.37,38.88 | JP2.2 44.67,26.33 44.67,18.18 v44.72,18.18 | v47.75,10.58 48.9,10.58 R13.2 | v69.71,37.28 66.58,37.28 v66.47,37.39
  Bottom 0.508: v44.72,18.18 47.75,15.15 v47.75,10.58 | JP2.2 42.46,31.6 46.69,35.84 51.49,35.84 53.94,38.29 61.4,38.29 61.9,38.79 62.17,38.79 62.29,38.86 62.55,38.79 65.07,38.79 v66.47,37.39 | v69.71,37.28 73.94,37.28 74.44,37.78 77.03,37.78 79.3,40.05 82.2,40.05 v83.37,38.88
SIGNAL_1  (via drill 0.35)
  Top 0.508: R2.2 51.34,34.04 OS1.E 51.1,36.7 v51.04,36.76 | U1.23 83.74,43.68 83.05,42.99 v79.09,42.99 | v70.68,39.06 66.82,39.06 v66.52,39.36
  Bottom 0.508: v79.09,42.99 74.63,38.53 71.34,38.53 70.82,39.06 v70.68,39.06 | v66.52,39.36 66.43,39.45 62.64,39.45 62.2,39.57 61.99,39.45 53.73,39.45 v51.04,36.76
SIGNAL_2  (via drill 0.35)
  Top 0.508: OS2.E 38.57,32.88 R4.2 v40.85,34.41 | v67.25,40.34 72.24,40.34 74.83,37.75 76.44,37.75 77.12,38.43 77.12,38.52 77.37,38.77 v81.83,38.77 | U1.24 87.3,44.48 v87.46,44.32
  Bottom 0.508: v40.85,34.41 46.56,40.12 61.48,40.12 62.13,40.5 67.09,40.5 v67.25,40.34 | v81.83,38.77 82.66,37.94 83.7,37.94 83.73,37.96 84.85,37.96 85.48,38.59 85.48,40.94 86.38,41.84 86.42,41.84 87.46,42.88 v87.46,44.32
SIGNAL_3  (via drill 0.35)
  Top 0.508: R6.2 28.28,28.93 OS3.E | U1.25 83.17,44.27 82.6,43.7 79.49,43.7 79.41,43.77 78.76,43.77 78.69,43.7 v77.69,43.7 | v71.75,39.33 71.75,38.66 71.22,38.13 69.53,38.13 69.48,38.17 66.14,38.17 66.1,38.13 65.01,38.13 64.74,38.2 64.62,38.13 64.28,38.13 63.79,37.64 63.79,37.04 63.75,36.91 63.79,36.85 63.79,34.01 62.17,32.39 62.17,31.86 61.76,31.45 57.4,31.45 57.39,31.45 56.74,31.45 v47.4,31.45 | v46.1,32.75 v44.28,34.57
  Bottom 0.508: v77.69,43.7 74.15,40.16 72.58,40.16 v71.75,39.33 | v47.4,31.45 v46.1,32.75 | v44.28,34.57 43.47,34.57 39.51,30.61 39.49,30.64 38.43,30.64 37.97,30.18 37.97,29.68 33.49,29.68 33.24,29.93 31.72,29.93 31.47,29.68 26.51,29.68 OS3.E
SIGNAL_4  (via drill 0.35)
  Top 0.508: R12.2 64.01,31.73 OS4.E | U1.26 82.37,47.16 82.91,47.7 v84.45,47.7 | v71.34,41.2 71.24,41.3 v67.69,41.3
  Bottom 0.508: v84.45,47.7 78.35,47.7 76.99,46.34 76.1,46.34 75.64,45.88 75.64,45.23 75.93,44.95 75.93,43.12 74.01,41.2 v71.34,41.2 | OS4.E 67.4,35.98 67.4,39.41 67.54,39.55 67.57,39.55 68.03,40.01 68.03,40.04 68.12,40.13 68.12,40.87 v67.69,41.3
SIGNAL_5  (via drill 0.35)
  Top 0.508: R10.2 73.89,31.45 75.96,29.37 OS5.E | U1.19 86.03,40.48 86.76,39.75 86.76,38.95 v84.33,36.52
  Bottom 0.508: v84.33,36.52 84.33,36.22 81.8,33.68 80.11,33.68 79.65,33.22 79.65,31.4 OS5.E
SIGNAL_6  (via drill 0.35)
  Top 0.508: OS6.E 54.08,21.5 R8.2 54.22,21.45 55.84,19.83 v56.34,19.83 | v86.71,41.06 86.71,41.63 85.46,42.88 U1.22
  Bottom 0.508: v56.34,19.83 56.42,19.75 65.65,19.75 69.02,23.12 69.02,27.85 69.99,28.82 69.99,29.76 70.25,30.02 70.25,31.58 69.92,31.91 69.92,32.32 74.72,37.12 83.19,37.12 83.35,37.28 83.98,37.28 84,37.3 85.14,37.3 86.71,38.87 v86.71,41.06
SS  (via drill 0.35)
  Top 0.508: U1.14 81.57,36.03 80.87,35.33 77.49,35.33 76.39,36.44 66.51,36.44 v66.47,36.4
  Bottom 0.508: v66.47,36.4 65.25,35.18 63.98,35.18 62.57,36.59 61.74,36.81 61.33,37.52 54.15,37.52 51.79,35.17 47.11,35.17 43.84,31.9 43.84,27.38 JP2.4
TX  (via drill 0.35)
  Top 0.508: U1.31 78.37,47.39 78.91,47.93 80.28,47.93 82.23,49.88 82.23,50.9 82.17,50.96 82.17,52.87 81.22,53.83 v80.56,53.83 | v61.3,72.35 57.89,68.94 51.84,68.94 50.01,67.11 50.01,66.54 50,66.53 50,50.03 43.09,43.12 v36.01,43.12 | v38.75,29.86 37.99,30.62 v37.19,30.62
  Bottom 0.508: v80.56,53.83 78.62,53.83 76.63,55.82 76.63,59.4 69.43,66.6 69.43,68.29 64.95,72.77 61.72,72.77 v61.3,72.35 | v36.01,43.12 38.19,40.94 42.32,40.94 43.58,39.68 43.58,38.92 39.09,34.43 38,34.43 37.19,33.62 v37.19,30.62 | JP2.8 43.63,22.08 43.63,23.94 43.57,24 43.57,24.17 42.91,24.83 41.97,24.83 41.09,25.72 41.09,26.48 40.2,27.37 39.43,27.37 38.75,28.05 v38.75,29.86

### Text on the board
tNames: Jakub Gal | 2020
bNames: Jakub Gal | 2020